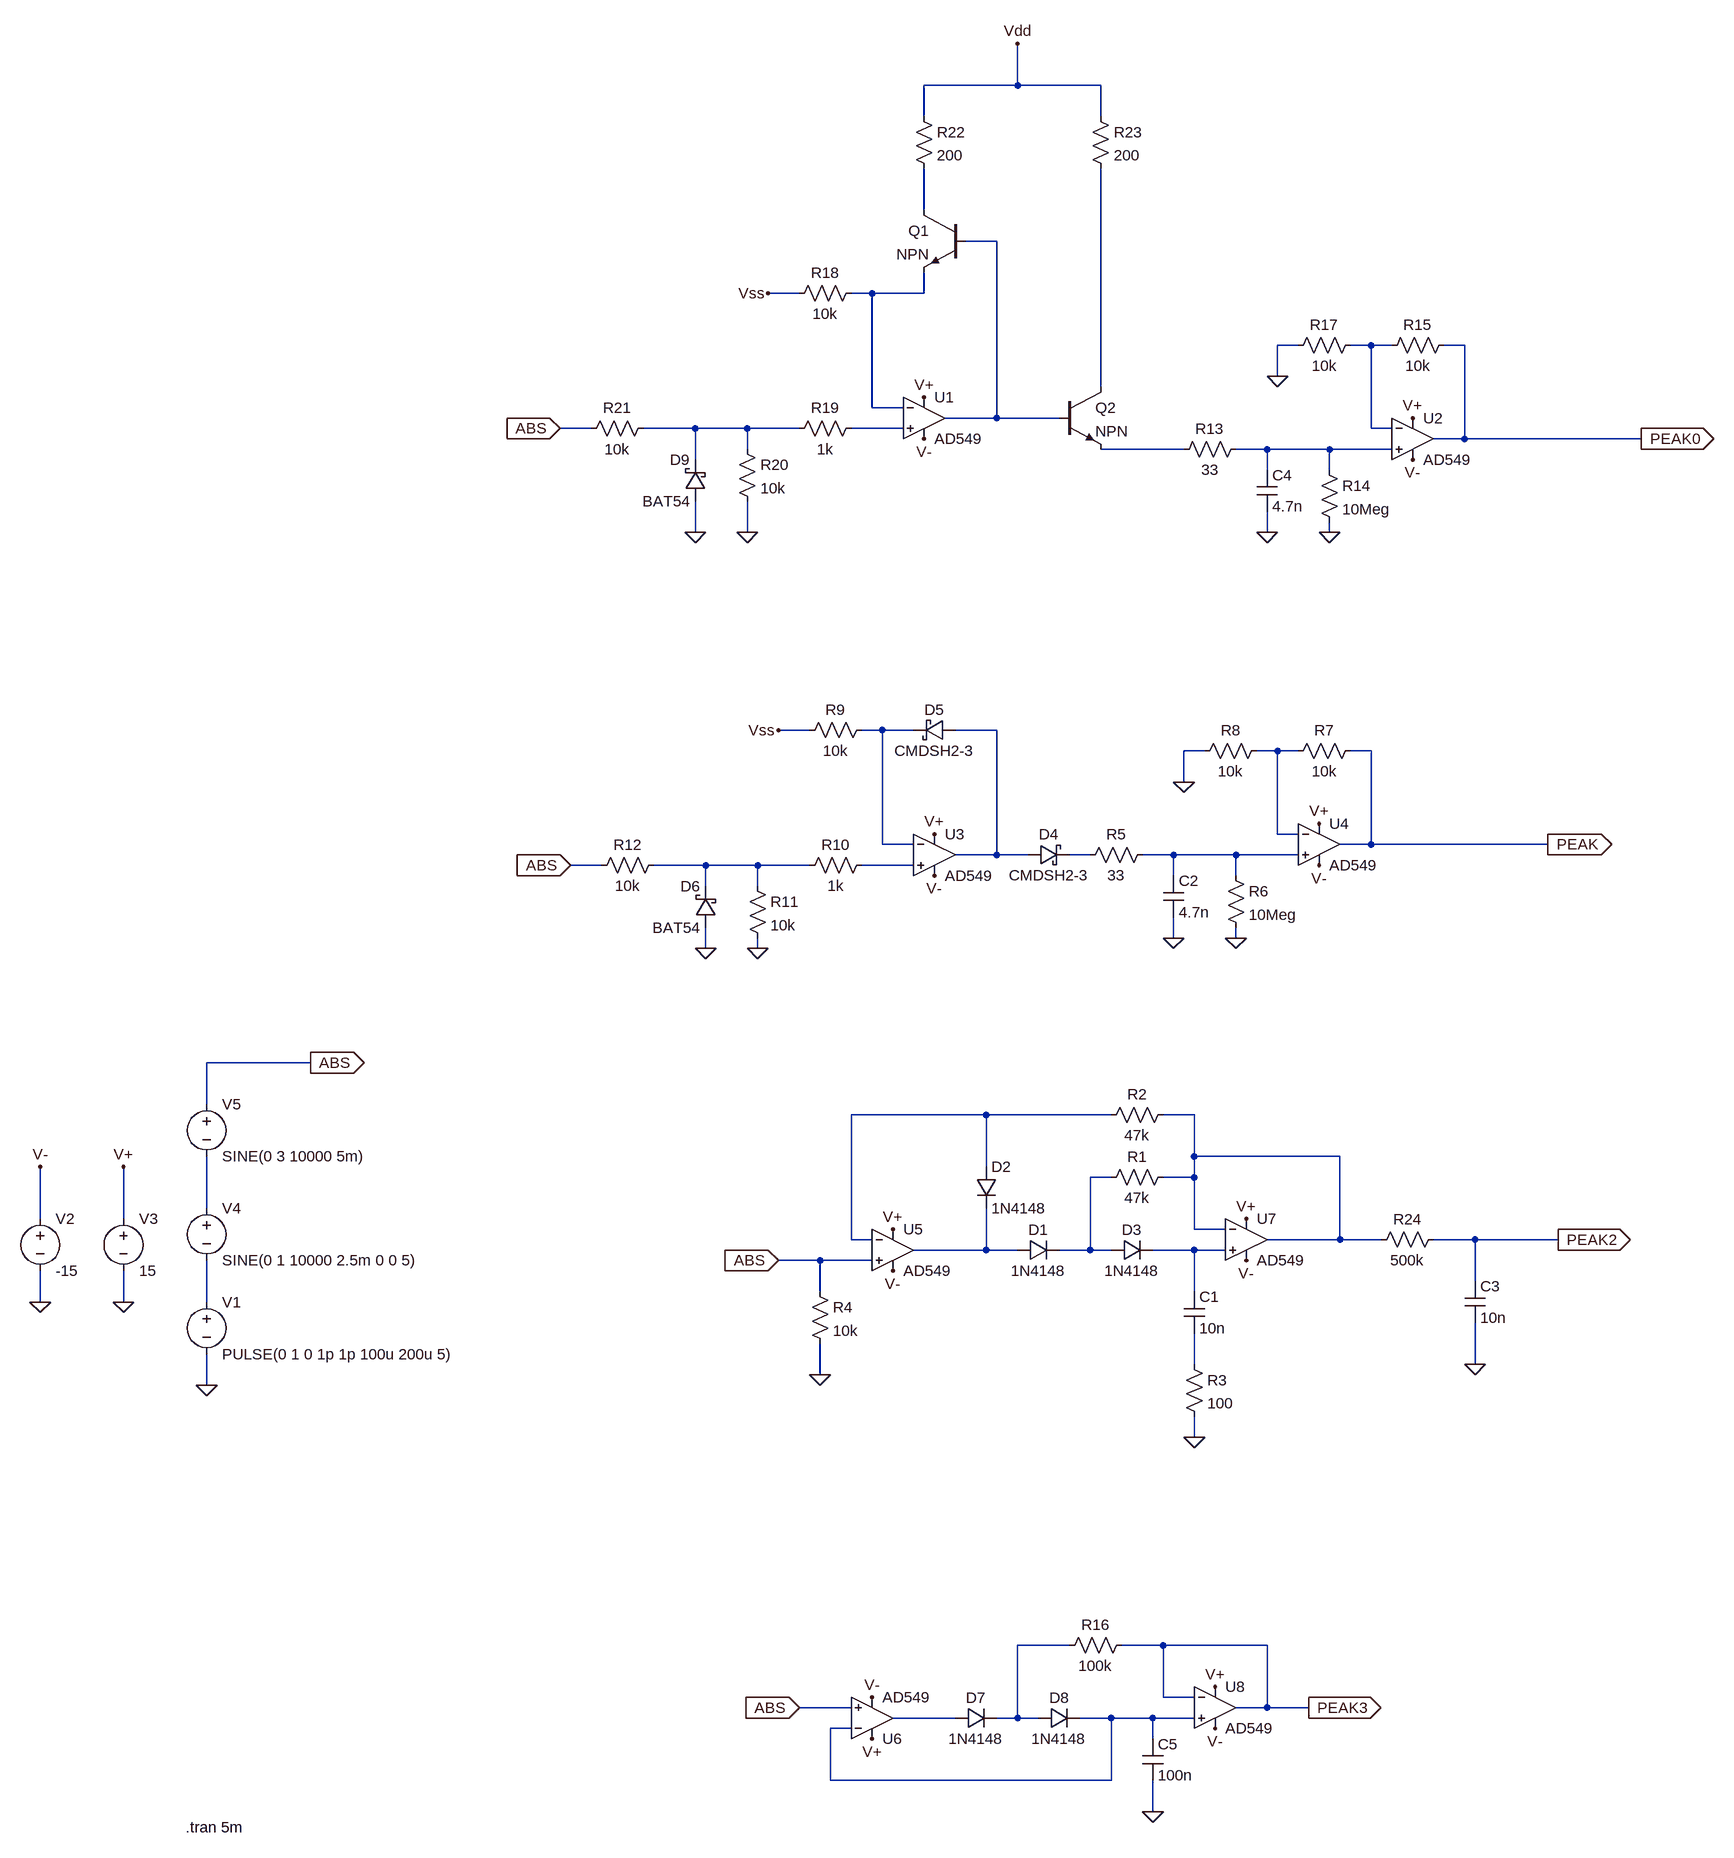
[diagram p0: schematic Peak Detector.asc]
Peak Detector.asc, the LTspice schematic file:
Version 4
SHEET 1 5368 1832
WIRE 2512 -864 2512 -928
WIRE 2512 -864 2368 -864
WIRE 2640 -864 2512 -864
WIRE 2368 -816 2368 -864
WIRE 2640 -816 2640 -864
WIRE 2368 -672 2368 -736
WIRE 2480 -624 2432 -624
WIRE 2176 -544 2128 -544
WIRE 2288 -544 2256 -544
WIRE 2368 -544 2368 -576
WIRE 2368 -544 2288 -544
WIRE 2944 -464 2912 -464
WIRE 3056 -464 3024 -464
WIRE 3088 -464 3056 -464
WIRE 3200 -464 3168 -464
WIRE 2912 -416 2912 -464
WIRE 2640 -400 2640 -736
WIRE 2288 -368 2288 -544
WIRE 2336 -368 2288 -368
WIRE 2480 -352 2480 -624
WIRE 2480 -352 2400 -352
WIRE 2576 -352 2480 -352
WIRE 1856 -336 1808 -336
WIRE 2016 -336 1936 -336
WIRE 2096 -336 2016 -336
WIRE 2176 -336 2096 -336
WIRE 2336 -336 2256 -336
WIRE 3056 -336 3056 -464
WIRE 3088 -336 3056 -336
WIRE 3200 -320 3200 -464
WIRE 3200 -320 3152 -320
WIRE 3472 -320 3200 -320
WIRE 2096 -304 2096 -336
WIRE 2768 -304 2640 -304
WIRE 2896 -304 2848 -304
WIRE 2992 -304 2896 -304
WIRE 3088 -304 2992 -304
WIRE 2016 -288 2016 -336
WIRE 2896 -272 2896 -304
WIRE 2992 -272 2992 -304
WIRE 2016 -176 2016 -224
WIRE 2096 -176 2096 -224
WIRE 2896 -176 2896 -208
WIRE 2992 -176 2992 -192
WIRE 2192 128 2144 128
WIRE 2304 128 2272 128
WIRE 2352 128 2304 128
WIRE 2480 128 2416 128
WIRE 2800 160 2768 160
WIRE 2912 160 2880 160
WIRE 2944 160 2912 160
WIRE 3056 160 3024 160
WIRE 2768 208 2768 160
WIRE 2912 288 2912 160
WIRE 2944 288 2912 288
WIRE 2304 304 2304 128
WIRE 2352 304 2304 304
WIRE 3056 304 3056 160
WIRE 3056 304 3008 304
WIRE 3328 304 3056 304
WIRE 2480 320 2480 128
WIRE 2480 320 2416 320
WIRE 2528 320 2480 320
WIRE 2624 320 2592 320
WIRE 2752 320 2704 320
WIRE 2848 320 2752 320
WIRE 2944 320 2848 320
WIRE 1872 336 1824 336
WIRE 2032 336 1952 336
WIRE 2112 336 2032 336
WIRE 2192 336 2112 336
WIRE 2352 336 2272 336
WIRE 2752 352 2752 320
WIRE 2848 352 2848 320
WIRE 2032 368 2032 336
WIRE 2112 368 2112 336
WIRE 2752 448 2752 416
WIRE 2848 448 2848 432
WIRE 2032 464 2032 432
WIRE 2112 464 2112 448
WIRE 1424 640 1264 640
WIRE 1264 704 1264 640
WIRE 2464 720 2256 720
WIRE 2656 720 2464 720
WIRE 2784 720 2736 720
WIRE 2784 784 2784 720
WIRE 3008 784 2784 784
WIRE 2464 800 2464 720
WIRE 2656 816 2624 816
WIRE 2784 816 2784 784
WIRE 2784 816 2736 816
WIRE 1264 864 1264 784
WIRE 1008 880 1008 800
WIRE 1136 880 1136 800
WIRE 2784 896 2784 816
WIRE 2832 896 2784 896
WIRE 2256 912 2256 720
WIRE 2288 912 2256 912
WIRE 3008 912 3008 784
WIRE 3008 912 2896 912
WIRE 3072 912 3008 912
WIRE 3216 912 3152 912
WIRE 3344 912 3216 912
WIRE 2464 928 2464 864
WIRE 2464 928 2352 928
WIRE 2512 928 2464 928
WIRE 2624 928 2624 816
WIRE 2624 928 2576 928
WIRE 2656 928 2624 928
WIRE 2784 928 2720 928
WIRE 2832 928 2784 928
WIRE 2208 944 2144 944
WIRE 2288 944 2208 944
WIRE 3216 976 3216 912
WIRE 2208 992 2208 944
WIRE 2784 992 2784 928
WIRE 1008 1008 1008 960
WIRE 1136 1008 1136 960
WIRE 1264 1008 1264 944
WIRE 2784 1104 2784 1056
WIRE 3216 1104 3216 1040
WIRE 2208 1120 2208 1072
WIRE 1264 1136 1264 1088
WIRE 2784 1216 2784 1184
WIRE 2592 1536 2512 1536
WIRE 2736 1536 2672 1536
WIRE 2896 1536 2736 1536
WIRE 2736 1616 2736 1536
WIRE 2784 1616 2736 1616
WIRE 2256 1632 2176 1632
WIRE 2896 1632 2896 1536
WIRE 2896 1632 2848 1632
WIRE 2960 1632 2896 1632
WIRE 2416 1648 2320 1648
WIRE 2512 1648 2512 1536
WIRE 2512 1648 2480 1648
WIRE 2544 1648 2512 1648
WIRE 2656 1648 2608 1648
WIRE 2720 1648 2656 1648
WIRE 2784 1648 2720 1648
WIRE 2256 1664 2224 1664
WIRE 2720 1680 2720 1648
WIRE 2224 1744 2224 1664
WIRE 2656 1744 2656 1648
WIRE 2656 1744 2224 1744
WIRE 2720 1792 2720 1744
FLAG 2784 1216 0
FLAG 2208 1120 0
FLAG 2144 944 ABS
IOPIN 2144 944 In
FLAG 3344 912 PEAK2
IOPIN 3344 912 Out
FLAG 2848 448 0
FLAG 2752 448 0
FLAG 2768 208 0
FLAG 2144 128 Vss
FLAG 2032 464 0
FLAG 2112 464 0
FLAG 1824 336 ABS
IOPIN 1824 336 In
FLAG 3328 304 PEAK
IOPIN 3328 304 Out
FLAG 2960 1632 PEAK3
IOPIN 2960 1632 Out
FLAG 2720 1792 0
FLAG 2176 1632 ABS
IOPIN 2176 1632 In
FLAG 1424 640 ABS
IOPIN 1424 640 Out
FLAG 1264 1136 0
FLAG 1136 1008 0
FLAG 1008 1008 0
FLAG 1136 800 V+
FLAG 1008 800 V-
FLAG 2896 -176 0
FLAG 2912 -416 0
FLAG 2128 -544 Vss
FLAG 1808 -336 ABS
IOPIN 1808 -336 In
FLAG 3472 -320 PEAK0
IOPIN 3472 -320 Out
FLAG 2512 -928 Vdd
FLAG 2368 -320 V-
FLAG 2368 -384 V+
FLAG 3120 -288 V-
FLAG 3120 -352 V+
FLAG 2384 352 V-
FLAG 2384 288 V+
FLAG 2976 336 V-
FLAG 2976 272 V+
FLAG 2320 960 V-
FLAG 2320 896 V+
FLAG 2864 944 V-
FLAG 2864 880 V+
FLAG 2816 1664 V-
FLAG 2816 1600 V+
FLAG 2288 1616 V-
FLAG 2288 1680 V+
FLAG 2992 -176 0
FLAG 2016 -176 0
FLAG 2096 -176 0
FLAG 3216 1104 0
SYMBOL diode 2512 944 R270
WINDOW 0 32 32 VTop 2
WINDOW 3 0 32 VBottom 2
SYMATTR InstName D1
SYMATTR Value 1N4148
SYMBOL diode 2448 800 R0
SYMATTR InstName D2
SYMATTR Value 1N4148
SYMBOL diode 2656 944 R270
WINDOW 0 32 32 VTop 2
WINDOW 3 0 32 VBottom 2
SYMATTR InstName D3
SYMATTR Value 1N4148
SYMBOL res 2752 800 R90
WINDOW 0 0 56 VBottom 2
WINDOW 3 32 56 VTop 2
SYMATTR InstName R1
SYMATTR Value 47k
SYMBOL res 2752 704 R90
WINDOW 0 0 56 VBottom 2
WINDOW 3 32 56 VTop 2
SYMATTR InstName R2
SYMATTR Value 47k
SYMBOL cap 2768 992 R0
SYMATTR InstName C1
SYMATTR Value 10n
SYMBOL res 2768 1088 R0
SYMATTR InstName R3
SYMATTR Value 100
SYMBOL res 2192 976 R0
SYMATTR InstName R4
SYMATTR Value 10k
SYMBOL schottky 2528 336 R270
WINDOW 0 32 32 VTop 2
WINDOW 3 0 32 VBottom 2
SYMATTR InstName D4
SYMATTR Value CMDSH2-3
SYMATTR Description Diode
SYMATTR Type diode
SYMBOL res 2720 304 R90
WINDOW 0 0 56 VBottom 2
WINDOW 3 32 56 VTop 2
SYMATTR InstName R5
SYMATTR Value 33
SYMBOL cap 2736 352 R0
SYMATTR InstName C2
SYMATTR Value 4.7n
SYMBOL res 2832 336 R0
SYMATTR InstName R6
SYMATTR Value 10Meg
SYMBOL res 3040 144 R90
WINDOW 0 0 56 VBottom 2
WINDOW 3 32 56 VTop 2
SYMATTR InstName R7
SYMATTR Value 10k
SYMBOL res 2896 144 R90
WINDOW 0 0 56 VBottom 2
WINDOW 3 32 56 VTop 2
SYMATTR InstName R8
SYMATTR Value 10k
SYMBOL schottky 2416 112 R90
WINDOW 0 0 32 VBottom 2
WINDOW 3 32 32 VTop 2
SYMATTR InstName D5
SYMATTR Value CMDSH2-3
SYMATTR Description Diode
SYMATTR Type diode
SYMBOL res 2288 112 R90
WINDOW 0 0 56 VBottom 2
WINDOW 3 32 56 VTop 2
SYMATTR InstName R9
SYMATTR Value 10k
SYMBOL res 2288 320 R90
WINDOW 0 0 56 VBottom 2
WINDOW 3 32 56 VTop 2
SYMATTR InstName R10
SYMATTR Value 1k
SYMBOL res 2096 352 R0
SYMATTR InstName R11
SYMATTR Value 10k
SYMBOL schottky 2048 432 R180
WINDOW 0 24 64 Left 2
WINDOW 3 24 0 Left 2
SYMATTR InstName D6
SYMATTR Value BAT54
SYMATTR Description Diode
SYMATTR Type diode
SYMBOL res 1968 320 R90
WINDOW 0 0 56 VBottom 2
WINDOW 3 32 56 VTop 2
SYMATTR InstName R12
SYMATTR Value 10k
SYMBOL cap 2704 1680 R0
SYMATTR InstName C5
SYMATTR Value 100n
SYMBOL diode 2416 1664 R270
WINDOW 0 32 32 VTop 2
WINDOW 3 0 32 VBottom 2
SYMATTR InstName D7
SYMATTR Value 1N4148
SYMBOL res 2688 1520 R90
WINDOW 0 0 56 VBottom 2
WINDOW 3 32 56 VTop 2
SYMATTR InstName R16
SYMATTR Value 100k
SYMBOL diode 2544 1664 R270
WINDOW 0 32 32 VTop 2
WINDOW 3 0 32 VBottom 2
SYMATTR InstName D8
SYMATTR Value 1N4148
SYMBOL voltage 1264 992 R0
WINDOW 123 0 0 Left 0
WINDOW 39 0 0 Left 0
SYMATTR InstName V1
SYMATTR Value PULSE(0 1 0 1p 1p 100u 200u 5)
SYMBOL voltage 1008 864 R0
WINDOW 123 0 0 Left 0
WINDOW 39 0 0 Left 0
SYMATTR InstName V2
SYMATTR Value -15
SYMBOL voltage 1136 864 R0
WINDOW 123 0 0 Left 0
WINDOW 39 0 0 Left 0
SYMATTR InstName V3
SYMATTR Value 15
SYMBOL voltage 1264 848 R0
WINDOW 123 0 0 Left 0
WINDOW 39 0 0 Left 0
SYMATTR InstName V4
SYMATTR Value SINE(0 1 10000 2.5m 0 0 5)
SYMBOL voltage 1264 688 R0
WINDOW 123 0 0 Left 0
WINDOW 39 0 0 Left 0
SYMATTR InstName V5
SYMATTR Value SINE(0 3 10000 5m)
SYMBOL res 2864 -320 R90
WINDOW 0 0 56 VBottom 2
WINDOW 3 32 56 VTop 2
SYMATTR InstName R13
SYMATTR Value 33
SYMBOL cap 2880 -272 R0
SYMATTR InstName C4
SYMATTR Value 4.7n
SYMBOL res 3184 -480 R90
WINDOW 0 0 56 VBottom 2
WINDOW 3 32 56 VTop 2
SYMATTR InstName R15
SYMATTR Value 10k
SYMBOL res 3040 -480 R90
WINDOW 0 0 56 VBottom 2
WINDOW 3 32 56 VTop 2
SYMATTR InstName R17
SYMATTR Value 10k
SYMBOL res 2272 -560 R90
WINDOW 0 0 56 VBottom 2
WINDOW 3 32 56 VTop 2
SYMATTR InstName R18
SYMATTR Value 10k
SYMBOL res 2272 -352 R90
WINDOW 0 0 56 VBottom 2
WINDOW 3 32 56 VTop 2
SYMATTR InstName R19
SYMATTR Value 1k
SYMBOL res 1952 -352 R90
WINDOW 0 0 56 VBottom 2
WINDOW 3 32 56 VTop 2
SYMATTR InstName R21
SYMATTR Value 10k
SYMBOL npn 2432 -672 M0
SYMATTR InstName Q1
SYMBOL npn 2576 -400 R0
SYMATTR InstName Q2
SYMBOL res 2352 -832 R0
SYMATTR InstName R22
SYMATTR Value 200
SYMBOL res 2624 -832 R0
SYMATTR InstName R23
SYMATTR Value 200
SYMBOL OpAmps\\AD549 2368 -416 R0
SYMATTR InstName U1
SYMBOL OpAmps\\AD549 3120 -384 R0
SYMATTR InstName U2
SYMBOL OpAmps\\AD549 2384 256 R0
SYMATTR InstName U3
SYMBOL OpAmps\\AD549 2976 240 R0
SYMATTR InstName U4
SYMBOL OpAmps\\AD549 2320 864 R0
SYMATTR InstName U5
SYMBOL OpAmps\\AD549 2864 848 R0
SYMATTR InstName U7
SYMBOL OpAmps\\AD549 2816 1568 R0
SYMATTR InstName U8
SYMBOL OpAmps\\AD549 2288 1712 M180
SYMATTR InstName U6
SYMBOL res 2976 -288 R0
SYMATTR InstName R14
SYMATTR Value 10Meg
SYMBOL res 2080 -320 R0
SYMATTR InstName R20
SYMATTR Value 10k
SYMBOL schottky 2032 -224 R180
WINDOW 0 24 64 Left 2
WINDOW 3 24 0 Left 2
SYMATTR InstName D9
SYMATTR Value BAT54
SYMATTR Description Diode
SYMATTR Type diode
SYMBOL res 3168 896 R90
WINDOW 0 0 56 VBottom 2
WINDOW 3 32 56 VTop 2
SYMATTR InstName R24
SYMATTR Value 500k
SYMBOL cap 3200 976 R0
SYMATTR InstName C3
SYMATTR Value 10n
TEXT 1232 1816 Left 2 !.tran 5m

The netlist it stands for:
* Peak Detector.asc
D1 N021 N019 1N4148
D2 N017 N021 1N4148
D3 N019 N022 1N4148
R1 N018 N019 47k
R2 N018 N017 47k
C1 N022 N024 10n
R3 N024 0 100
R4 ABS 0 10k
D4 N011 N013 CMDSH2-3
R5 N014 N013 33
C2 N014 0 4.7n
R6 N014 0 10Meg
R7 PEAK N012 10k
R8 N012 0 10k
D5 N011 N010 CMDSH2-3
R9 N010 Vss 10k
R10 N016 N015 1k
R11 N015 0 10k
D6 0 N015 BAT54
R12 N015 ABS 10k
C5 N027 0 100n
D7 N026 N025 1N4148
R16 PEAK3 N025 100k
D8 N025 N027 1N4148
V1 N023 0 PULSE(0 1 0 1p 1p 100u 200u 5)
V2 V- 0 -15
V3 V+ 0 15
V4 N020 N023 SINE(0 1 10000 2.5m 0 0 5)
V5 ABS N020 SINE(0 3 10000 5m)
R13 N009 N008 33
C4 N009 0 4.7n
R15 PEAK0 N004 10k
R17 N004 0 10k
R18 N003 Vss 10k
R19 N007 N006 1k
R21 N006 ABS 10k
Q1 N001 N002 N003 0 NPN
Q2 N005 N002 N008 0 NPN
R22 Vdd N001 200
R23 Vdd N005 200
XU1 N007 N003 V+ V- N002 AD549  ; pins In+ In- V+ V- OUT
XU2 N009 N004 V+ V- PEAK0 AD549  ; pins In+ In- V+ V- OUT
XU3 N016 N010 V+ V- N011 AD549  ; pins In+ In- V+ V- OUT
XU4 N014 N012 V+ V- PEAK AD549  ; pins In+ In- V+ V- OUT
XU5 ABS N017 V+ V- N021 AD549  ; pins In+ In- V+ V- OUT
XU7 N022 N018 V+ V- N018 AD549  ; pins In+ In- V+ V- OUT
XU8 N027 PEAK3 V+ V- PEAK3 AD549  ; pins In+ In- V+ V- OUT
XU6 ABS N027 V+ V- N026 AD549  ; pins In+ In- V+ V- OUT
R14 N009 0 10Meg
R20 N006 0 10k
D9 0 N006 BAT54
R24 PEAK2 N018 500k
C3 PEAK2 0 10n
.model D D
.lib standard.dio
.model NPN NPN
.model PNP PNP
.lib standard.bjt
.tran 5m
.backanno
.end